# Altium schematic sheet Power.SchDoc: Power
size Tabloid; ApprovedBy: NA; CompanyName: Cospan Design LLC; DrawnBy: Dave McCoy; Engineer: Dave McCoy; DocumentNumber: 17; Revision: A; SheetNumber: 17; SheetTotal: 20; Client: Public; Project: Enigma; ProjectPrettyName: Enigma
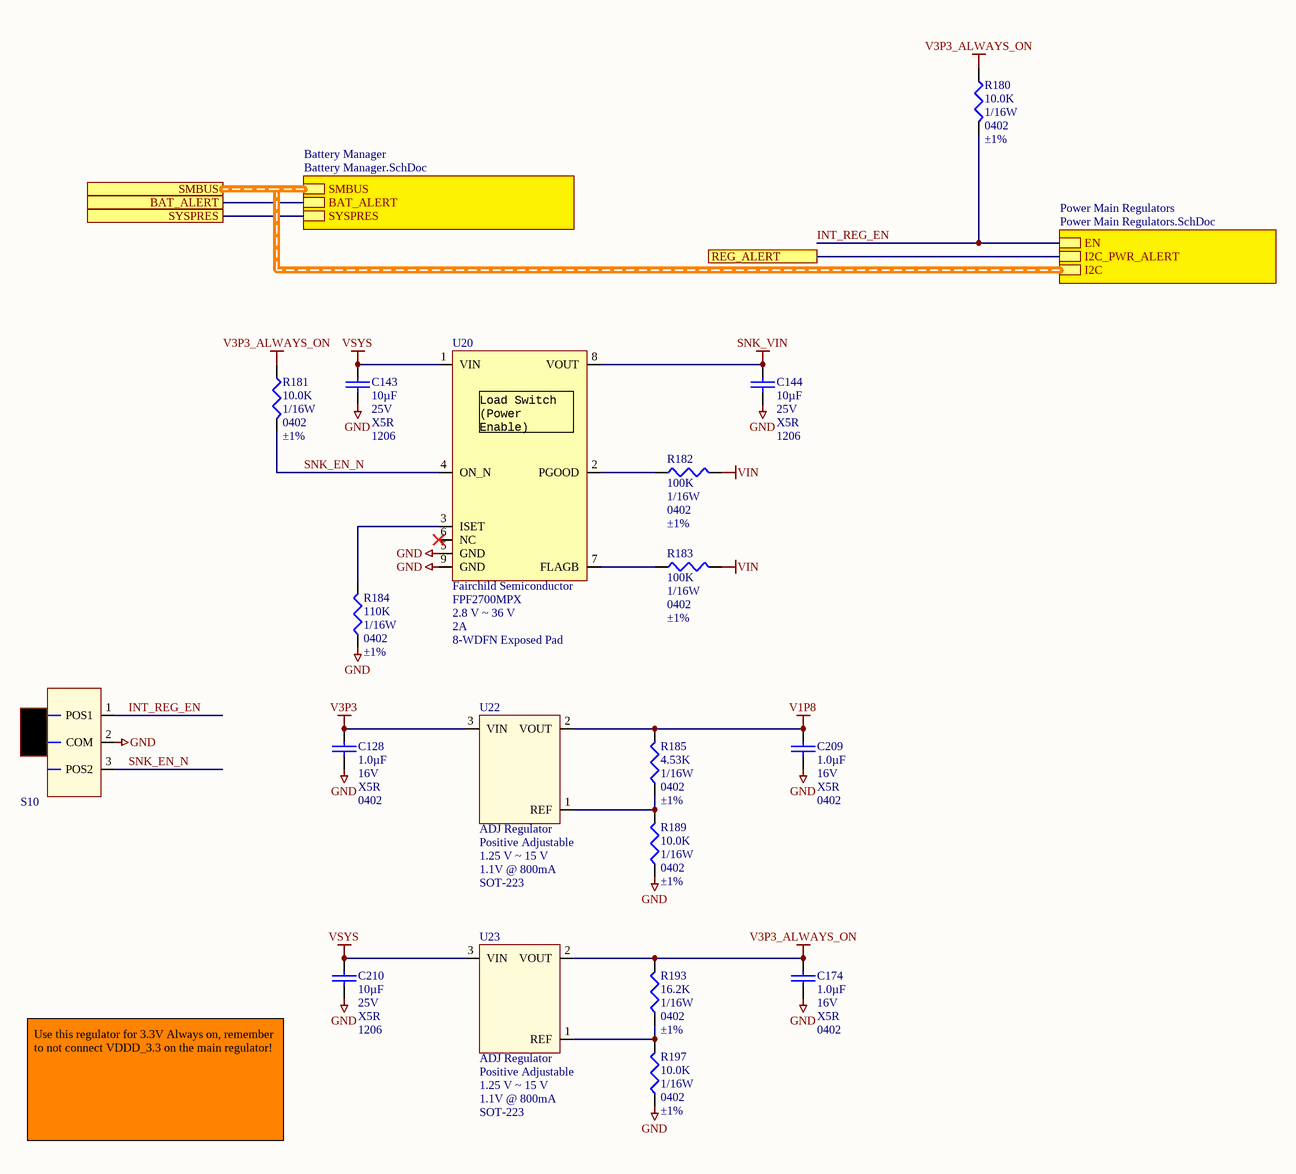
[diagram p0: Power.SchDoc]

## Parts
C128  Capacitance: 1.0µF  Voltage - Rated: 16V  Temperature Coefficient: X5R  Package / Case: 0402  [C_ERA-0402]  (hidden comment: 1.0uF)
C143  Voltage - Rated: 25V  Temperature Coefficient: X5R  Package / Case: 1206  [CAP-1206]  (hidden comment: 10µF)
C144  Voltage - Rated: 25V  Temperature Coefficient: X5R  Package / Case: 1206  [CAP-1206]  (hidden comment: 10µF)
C174  Capacitance: 1.0µF  Voltage - Rated: 16V  Temperature Coefficient: X5R  Package / Case: 0402  [C_ERA-0402]  (hidden comment: 1.0uF)
C209  Capacitance: 1.0µF  Voltage - Rated: 16V  Temperature Coefficient: X5R  Package / Case: 0402  [C_ERA-0402]  (hidden comment: 1.0uF)
C210  Voltage - Rated: 25V  Temperature Coefficient: X5R  Package / Case: 1206  [CAP-1206]  (hidden comment: 10µF)
R180  Resistance In Ohms: 10.0K  Power (Watts): 1/16W  Case: 0402  Tolerance: ±1%  [R_0402]  (hidden comment: R_0402_10.0K)
R181  Resistance In Ohms: 10.0K  Power (Watts): 1/16W  Case: 0402  Tolerance: ±1%  [R_0402]  (hidden comment: R_0402_10.0K)
R182  Resistance In Ohms: 100K  Power (Watts): 1/16W  Case: 0402  Tolerance: ±1%  [R_0402]  (hidden comment: R_0402_100K)
R183  Resistance In Ohms: 100K  Power (Watts): 1/16W  Case: 0402  Tolerance: ±1%  [R_0402]  (hidden comment: R_0402_100K)
R184  Power (Watts): 1/16W  Case: 0402  Tolerance: ±1%  [R_0402]  (hidden comment: 110K)
R185  Resistance In Ohms: 4.53K  Power (Watts): 1/16W  Case: 0402  Tolerance: ±1%  [R_0402]  (hidden comment: 4.53k Ohms)
R189  Resistance In Ohms: 10.0K  Power (Watts): 1/16W  Case: 0402  Tolerance: ±1%  [R_0402]  (hidden comment: R_0402_10.0K)
R193  Resistance In Ohms: 16.2K  Power (Watts): 1/16W  Case: 0402  Tolerance: ±1%  [R_0402]  (hidden comment: R_0402_16.2K)
R197  Resistance In Ohms: 10.0K  Power (Watts): 1/16W  Case: 0402  Tolerance: ±1%  [R_0402]  (hidden comment: R_0402_10.0K)
S10  Micro Slide Switch  [PCM_SMD_SWITCH]  (value not drawn)
U20  Manufacturer: Fairchild Semiconductor  Manufacturer Part Number: FPF2700MPX  Voltage - Load: 2.8 V ~ 36 V  Current - Output (Max): 2A  Package / Case: 8-WDFN Exposed Pad  [SON65P300X80_HS-9N]  (hidden comment: U_FPF2700MPX)
U22  ADJ Regulator  Regulator Topology: Positive Adjustable  Voltage - Output: 1.25 V ~ 15 V  Voltage - Dropout (Typical): 1.1V @ 800mA  Supplier Device Package: SOT-223  [SOT230P700X180-4N]
U23  ADJ Regulator  Regulator Topology: Positive Adjustable  Voltage - Output: 1.25 V ~ 15 V  Voltage - Dropout (Typical): 1.1V @ 800mA  Supplier Device Package: SOT-223  [SOT230P700X180-4N]

## Sub-sheets
Battery Manager = Battery Manager.SchDoc: SMBUS (harness I2C Harness), BAT_ALERT, SYSPRES
Power Main Regulators = Power Main Regulators.SchDoc: I2C_PWR_ALERT, EN, I2C (harness I2C Harness)

## Ports
BAT_ALERT, REG_ALERT, SMBUS (harness I2C Harness), SYSPRES

## Nets
GND: C128.1 C143.1 C144.1 C174.1 C209.1 C210.1 R184.2 R189.2 R197.2 S10.2(COM) U20.5(GND) U20.9(GND)
SNK_VIN: C144.2 U20.8(VOUT)
V1P8: C209.2 R185.1 U22.2(VOUT)
V3P3: C128.2 U22.3(VIN)
V3P3_ALWAYS_ON: C174.2 R180.2 R181.2 R193.1 U23.2(VOUT)
VIN: R182.1 R183.1
VSYS: C143.2 C210.2 U20.1(VIN) U23.3(VIN)
BAT_ALERT: port BAT_ALERT, sheet Battery Manager/BAT_ALERT
INT_REG_EN: R180.1 S10.1(POS1) ; sheet Power Main Regulators/EN
REG_ALERT: port REG_ALERT, sheet Power Main Regulators/I2C_PWR_ALERT
SNK_EN_N: R181.1 S10.3(POS2) U20.4(ON_N)
SYSPRES: port SYSPRES, sheet Battery Manager/SYSPRES
NetR182_2: R182.2 U20.2(PGOOD)
NetR183_2: R183.2 U20.7(FLAGB)
NetR184_1: R184.1 U20.3(ISET)
NetR185_2: R185.2 R189.1 U22.1(REF)
NetR193_2: R193.2 R197.1 U23.1(REF)

Not connected (* = marked no-connect by the designer): U20 6(NC)*

## Buses and harness runs
harness port SMBUS = sheet Battery Manager/SMBUS = sheet Power Main Regulators/I2C

## Notes on the sheet
- Use this regulator for 3.3V Always on, remember to not connect VDDD_3.3 on the main regulator!
- Project:
- http://www.cospandesign.com
- Cospan Design
- Document:
- Engineer:
- Title:
- Client:
- Approved By:
- Revision:
- Date:
- Number:
- of
- (in symbol U_FPF2700MPX) Load Switch / (Power Enable)

## Library data of the parts
C128 C174 C209 = C_0402_1.0UF_16V: CAP CER 1.0UF 16V X5R 0402; Manufacturer: Taiyo Yuden; Manufacturer Part Number: EMK105BJ105KV-F; Tolerance: ±10%; Supplier 1: Digi-Key; RoHS: RoHS Compliant; Category: Capacitors; Stock 1: 489909; Pricing 1: 1=0.1, 10=0.063, 100=0.028, 500=0.01998, 1000=0.0157, 2500=0.01427, 5000=0.01313 (USD); Packaging: Cut Tape (CT); Part Status: Active; Operating Temperature: -55°C ~ 85°C; Features: -; Ratings: -; Applications: General Purpose; Mounting Type: Surface Mount, MLCC; Size / Dimension: 0.039" L x 0.020" W (1.00mm x 0.50mm); Height - Seated (Max): -; Thickness (Max): 0.022" (0.55mm); Lead Spacing: -; Lead Style: -; ComponentLink1URL: http://ds.yuden.co.jp/TYCOMPAS/ut/detail.do?productNo=EMK105BJ105KV-F&fileName=EMK105BJ105KV-F_SS&mode=specSheetDownload; ComponentLink1Description: http://ds.yuden.co.jp/TYCOMPAS/ut/detail.do?productNo=EMK105BJ105KV-F&fileName=EMK105BJ105KV-F_SS&mode=specSheetDownload; Supplier Part Number 1: 587-2477-1-ND
C143 C144 C210 = C_1206_10UF_25V: CAP CER 10UF 25V X5R 1206; Manufacturer: Murata Electronics North America; Manufacturer Part Number: GRM31CR61E106MA12L; Tolerance: ±20%; Supplier 1: Digi-Key; Supplier Part Number 1: 490-5423-1-ND; RoHS: RoHS Compliant; Category: Capacitors; Stock 1: 359069; Pricing: 1=0.51, 10=0.402, 50=0.2646, 100=0.2099, 250=0.15512, 500=0.12046, 1000=0.0949 (USD); Mounting Type: Surface Mount, MLCC; Operating Temperature: -55°C ~ 85°C; Applications: General Purpose; Ratings: -; Size / Dimension: 0.126" L x 0.063" W (3.20mm x 1.60mm); Height: -; Thickness: 0.071" (1.80mm); Lead Spacing: -; Features: -; Packaging: Cut Tape (CT); Lead Style: -; ComponentLink1URL: http://search.murata.co.jp/Ceramy/image/img/PDF/ENG/GRM31CR61E106MA12.pdf; ComponentLink1Description: http://search.murata.co.jp/Ceramy/image/img/PDF/ENG/GRM31CR61E106MA12.pdf; Capacitance: 10µF
R180 R181 R189 R197 = R_0402_10.0K: RES 10.0K OHM 1/16W 1% 0402 SMD; Manufacturer: Stackpole Electronics Inc; Manufacturer Part Number: RMCF0402FT10K0; Resistance (Ohms): 10k; Temperature Coefficient: ±100ppm/°C; Supplier 1: Digi-Key; Supplier Part Number 1: RMCF0402FT10K0CT-ND; RoHS: RoHS Compliant; Category: Resistors; Stock 1: 234525; Pricing: 1=0.04, 10=0.025, 50=0.0138, 100=0.0105, 250=0.0078, 500=0.00576, 1000=0.00384, 2500=0.00324, 5000=0.0027 (USD); Composition: Thick Film; Features: -; Package / Case: 0402 (1005 Metric); Size / Dimension: 0.039" L x 0.020" W (1.00mm x 0.50mm); Height: 0.016" (0.40mm); Number of Terminations: 2; Packaging: Cut Tape (CT); ComponentLink1URL: http://www.seielect.com/Catalog/SEI-RMCF_RMCP.pdf; ComponentLink1Description: http://www.seielect.com/Catalog/SEI-RMCF_RMCP.pdf
R182 R183 = R_0402_100K: RES SMD 100K OHM 1% 1/16W 0402; Manufacturer: Yageo; Manufacturer Part Number: RC0402FR-07100KL; Temperature Coefficient: ±100ppm/°C; Supplier 1: Digi-Key; RoHS: RoHS Compliant; Category: Resistors; Stock 1: 4989982; Pricing 1: 1=0.1, 10=0.013, 25=0.0096, 100=0.0054, 250=0.00412, 500=0.00328, 1000=0.00242, 2500=0.0021, 5000=0.00173 (USD); Packaging: Cut Tape (CT); Resistance (Ohms): 100k; Composition: Thick Film; Features: Moisture Resistant; Operating Temperature: -55°C ~ 155°C; Package / Case: 0402 (1005 Metric); Supplier Device Package: 0402; Size / Dimension: 0.039" L x 0.020" W (1.00mm x 0.50mm); Height: 0.016" (0.40mm); Number of Terminations: 2; ComponentLink1URL: http://www.yageo.com/NewPortal/yageodocoutput?fileName=/pdf/R-Chip/PYu-RC_Group_51_RoHS_L_3.pdf; ComponentLink1Description: http://www.yageo.com/NewPortal/yageodocoutput?fileName=/pdf/R-Chip/PYu-RC_Group_51_RoHS_L_3.pdf; Supplier Part Number 1: 311-100KLRCT-ND
R184 = R_0402_110K: RES 110K OHM 1/10W 1% 0402 SMD; Manufacturer: Panasonic Electronic Components; Manufacturer Part Number: ERJ-2RKF1103X; Temperature Coefficient: ±100ppm/°C; Supplier 1: Digi-Key; Supplier Part Number 1: P110KLCT-ND; RoHS: RoHS Compliant; Category: Resistors; Stock 1: 125624; Pricing: 1=0.1, 50=0.0242, 100=0.0184, 250=0.01364, 500=0.01008, 1000=0.00672, 5000=0.00473 (USD); Packaging: Cut Tape (CT); Resistance (Ohms): 110k; Composition: Thick Film; Features: -; Package / Case: 0402 (1005 Metric); Supplier Device Package: 0402; Size / Dimension: 0.039" L x 0.020" W (1.00mm x 0.50mm); Height: 0.016" (0.40mm); Number of Terminations: 2; ComponentLink1URL: http://industrial.panasonic.com/www-cgi/jvcr13pz.cgi?E+PZ+3+AOA0002+ERJ2RKF1103X+7+WW; ComponentLink1Description: http://industrial.panasonic.com/www-cgi/jvcr13pz.cgi?E+PZ+3+AOA0002+ERJ2RKF1103X+7+WW; Resistance In Ohms: 110K
R185 = R_0402_4.53K: RES 4.53K OHM 1/16W 1% 0402 SMD; Manufacturer: Vishay/Dale; Manufacturer Part Number: CRCW04024K53FKED; Temperature Coefficient: ±100ppm/°C; Supplier 1: Digi-Key; Supplier Part Number 1: 541-4.53KLCT-ND; RoHS: RoHS Compliant; Category: Resistors; Stock 1: 103350; Pricing: 10=0.083, 50=0.0444, 200=0.0255, 1000=0.0174 (USD); Resistance (Ohms): 4.53K; Composition: Thick Film; Features: -; Size / Dimension: 0.039" L x 0.020" W (1.00mm x 0.50mm); Height: 0.014" (0.35mm); Number of Terminations: 2; Packaging: Cut Tape (CT); Package / Case: 0402 (1005 Metric); ComponentLink1URL: http://www.vishay.com/doc?20035; ComponentLink1Description: http://www.vishay.com/doc?20035
R193 = R_0402_16.2K: RES 16.2K OHM 1/16W 1% 0402 SMD; Manufacturer: Yageo; Manufacturer Part Number: RC0402FR-0716K2L; Temperature Coefficient: ±100ppm/°C; Supplier 1: Digi-Key; Supplier Part Number 1: 311-16.2KLRCT-ND; RoHS: RoHS Compliant; Category: Resistors; Stock 1: 103870; Pricing: 10=0.014, 50=0.0104, 100=0.0079, 250=0.00584, 500=0.00432, 1000=0.00288 (USD); Resistance (Ohms): 16.2K; Composition: Thick Film; Features: -; Size / Dimension: 0.039" L x 0.020" W (1.00mm x 0.50mm); Height: 0.016" (0.40mm); Number of Terminations: 2; Packaging: Cut Tape (CT); Package / Case: 0402 (1005 Metric); ComponentLink1URL: http://www.yageo.com/documents/recent/PYu-RC0402_51_RoHS_L_6.pdf; ComponentLink1Description: http://www.yageo.com/documents/recent/PYu-RC0402_51_RoHS_L_6.pdf
S10 = S_MICRO_SLIDE_SWITCH_ON_OFF: SWITCH SLIDE SPDT 300MA 6V; Manufacturer: C&K Components; Manufacturer Part Number: PCM12SMTR; Contact Timing: Not Specified; Switch Function: On-On; Current Rating: 300mA (DC); Actuator Type: Standard; Actuator Length: 1.50mm; Actuator Material: Polyamide (PA46), Nylon 4/6; Mechanical Life: 10,000 Cycles; Supplier 1: Digi-Key; RoHS: RoHS Compliant; Category: Switches; Stock 1: 29326; Pricing 1: 1=0.82, 10=0.787, 25=0.7704, 50=0.6884, 100=0.6556, 250=0.6392, 500=0.54088, 1000=0.52448 (USD); Packaging: Cut Tape (CT); Circuit: SPDT; Voltage Rating - AC: -; Voltage Rating - DC: 6V; Contact Material: Copper Alloy; Contact Finish: Silver; Mounting Type: Surface Mount, Right Angle; Termination Style: Gull Wing; Features: -; Switch Travel: 1.50mm; Operating Temperature: -20°C ~ 85°C; Electrical Life: -; Operating Force: -; ComponentLink1URL: http://www.ck-components.com/index.php?module=media&action=Display&cmpref=14389&lang=en&width=&height=&format=&alt=; ComponentLink1Description: http://www.ck-components.com/index.php?module=media&action=Display&cmpref=14389&lang=en&width=&height=&format=&alt=; Supplier Part Number 1: 401-2016-1-ND
U20 = U_FPF2700MPX: IC LOAD SWITCH CURR LIMIT 8-MLP; Switch Type: General Purpose; Number of Outputs: 1; Ratio - Input:Output: 1:1; Output Configuration: High Side; Output Type: N-Channel; Interface: On/Off; Voltage - Supply (Vcc/Vdd): Not Required; Rds On (Typ): 88 mOhm; Input Type: Non-Inverting; Fault Protection: Current Limiting (Adjustable), Over Temperature, UVLO; Supplier 1: Digi-Key; RoHS: RoHS Compliant; Category: Integrated Circuits (ICs); Stock 1: 7665; Pricing 1: 1=2.71, 10=2.43, 100=1.9491, 500=1.602, 1000=1.3261 (USD); Packaging: Cut Tape (CT); Features: Auto Restart, Power Good, Slew Rate Controlled, Status Flag; Operating Temperature: -40°C ~ 85°C (TA); Supplier Device Package: 8-MLP (3x3); ComponentLink1URL: http://www.fairchildsemi.com/datasheets/FP/FPF2700.pdf; ComponentLink1Description: http://www.fairchildsemi.com/datasheets/FP/FPF2700.pdf; Supplier Part Number 1: FPF2700MPXCT-ND
U22 U23 = U_LD117STR: IC REG LDO ADJ 950MA SOT-223; Manufacturer: STMicroelectronics; Manufacturer Part Number: LD1117STR; Voltage - Input: Up to 15V; Number of Regulators: 1; Supplier 1: Digi-Key; Supplier Part Number 1: 497-1244-1-ND; RoHS: RoHS Compliant; Category: Integrated Circuits (ICs); Stock 1: 16599; Pricing: 1=0.54, 10=0.436, 100=0.3267, 250=0.28216, 500=0.24256, 1000=0.1881 (USD); Current - Output: 950mA; Current - Limit (Min): -; Operating Temperature: 0°C ~ 125°C; Mounting Type: Surface Mount; Package / Case: TO-261-4, TO-261AA; Packaging: Cut Tape (CT); ComponentLink1URL: http://www.st.com/internet/com/TECHNICAL_RESOURCES/TECHNICAL_LITERATURE/DATASHEET/CD00000544.pdf; ComponentLink1Description: http://www.st.com/internet/com/TECHNICAL_RESOURCES/TECHNICAL_LITERATURE/DATASHEET/CD00000544.pdf